# EAGLE design Combat (EAGLE 9.6.2)
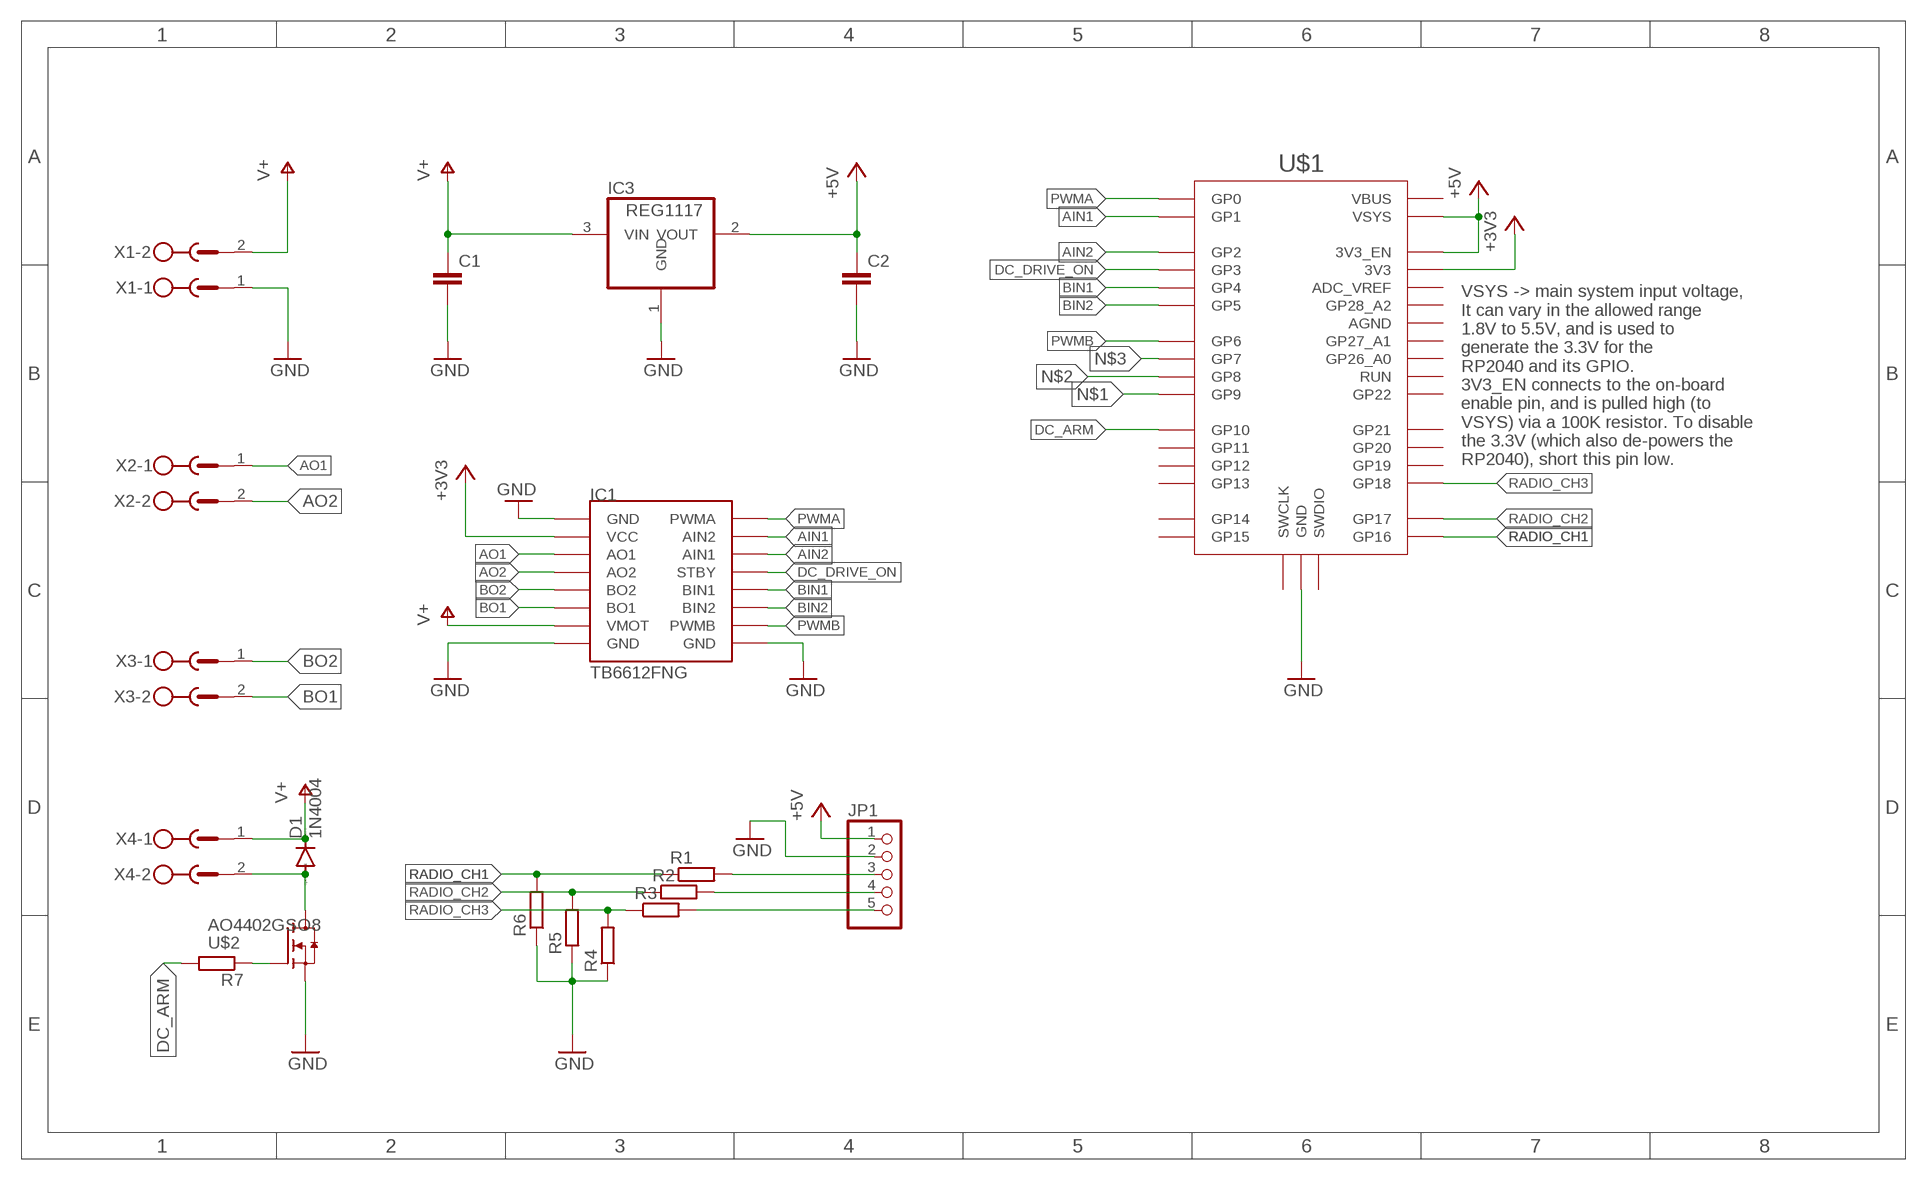
[diagram p0: schematic, sheet 1]

## Parts
C1  C-EUC1206  [C1206]
C2  C-EUC1206  [C1206]
D1  1N4004  [DO41-10]
IC1  MODUL_POLOLU  [MODUL_POLOLU]
IC3  REG1117  [SOT223]
JP1  PINHD-1X5  [1X05]
R1  R-EU_R1206  [R1206]
R2  R-EU_R1206  [R1206]
R3  R-EU_R1206  [R1206]
R4  R-EU_R1206  [R1206]
R5  R-EU_0204/7  [0204/7]
R6  R-EU_R1206  [R1206]
R7  R-EU_R1206  [R1206]
U$1  RPI_PICO-TH  [RPI_PICO_TH]
U$2  AO4402GSO8  [SO8]
X1  MSTBV2  [MSTBV2]
X2  MSTBV2  [MSTBV2]
X3  MSTBV2  [MSTBV2]
X4  MSTBV2  [MSTBV2]

## Nets
+3V3: IC1.VCC U$1.3V3
+5V: C2.1 IC3.2(VOUT) JP1.1 U$1.3V3_EN U$1.VSYS
AIN1: IC1.AIN2 U$1.GP1
AIN2: IC1.AIN1 U$1.GP2
AO1: IC1.AO1 X2.1
AO2: IC1.A02(AO2) X2.2
BIN1: IC1.BIN1 U$1.GP4
BIN2: IC1.BIN2 U$1.GP5
BO1: IC1.BO1 X3.2
BO2: IC1.BO2 X3.1
DC_ARM: R7.2 U$1.GP10
DC_DRIVE_ON: IC1.STBY U$1.GP3
GND: C1.2 C2.2 IC1.GND1(GND) IC1.GND2(GND) IC1.GND3(GND) IC3.1(GND) JP1.2 R4.1 R5.1 R6.1 U$1.GND@1(GND) U$1.GND@2(GND) U$1.GND@3(GND) U$1.GND@4(GND) U$1.GND@5(GND) U$1.GND@6(GND) U$1.GND@7(GND) U$1.GND@8(GND) U$2.1(S) U$2.2(S) U$2.3(S) X1.1
N$1: JP1.3 R1.2 U$1.GP9
N$2: JP1.4 R2.2 U$1.GP8
N$3: JP1.5 R3.2 U$1.GP7
N$4: D1.A U$2.5(D) U$2.6(D) U$2.7(D) U$2.8(D) X4.2
N$5: R7.1 U$2.4(G)
PWMA: IC1.PWMA U$1.GP0
PWMB: IC1.PWMB U$1.GP6
RADIO_CH1: R1.1 R6.2 U$1.GP16
RADIO_CH2: R2.1 R5.2 U$1.GP17
RADIO_CH3: R3.1 R4.2 U$1.GP18
V+: C1.1 D1.C IC1.VMOT IC3.3(VIN) X1.2 X4.1
Unconnected: U$1.ADC_VREF U$1.AGND U$1.GP11 U$1.GP12 U$1.GP13 U$1.GP14 U$1.GP15 U$1.GP19 U$1.GP20 U$1.GP21 U$1.GP22 U$1.GP26_A0 U$1.GP27_A1 U$1.GP28_A2 U$1.RUN U$1.SWCLK U$1.SWDIO U$1.VBUS

## Notes on the sheet
- VSYS -> main system input voltage,
  It can vary in the allowed range
  1.8V to 5.5V, and is used to
  generate the 3.3V for the
  RP2040 and its GPIO.
  3V3_EN connects to the on-board
  enable pin, and is pulled high (to
  VSYS) via a 100K resistor. To disable
  the 3.3V (which also de-powers the
  RP2040), short this pin low.

## Library data of the parts
C1 C2 = rcl:C-EU: CAPACITOR, European symbol; SPICEPREFIX: C
D1 = diode:1N4004: DIODE general purpose rectifier, 1 A
IC1 = TB6612FNG:MODUL_POLOLU
IC3 = burr-brown:REG1117: 800mA and 1A Low Dropout (LDO) Positive Regulator 1.8V, 2.5V, 2.85V, 3.3V, 5V, and Adj; MPN: REG1117; OC_FARNELL: 1097566; OC_NEWARK: 14P6981
JP1 = pinhead:PINHD-1X5: PIN HEADER
R1-R7 = rcl:R-EU_: RESISTOR, European symbol; SPICEPREFIX: R
U$1 = RaspberryPi_Pico:RPI_PICO
U$2 = AO4402G:AO4402G
X1-X4 = con-phoenix-500:MSTBV2: PHOENIX; OC_FARNELL: unknown; OC_NEWARK: unknown

## Board
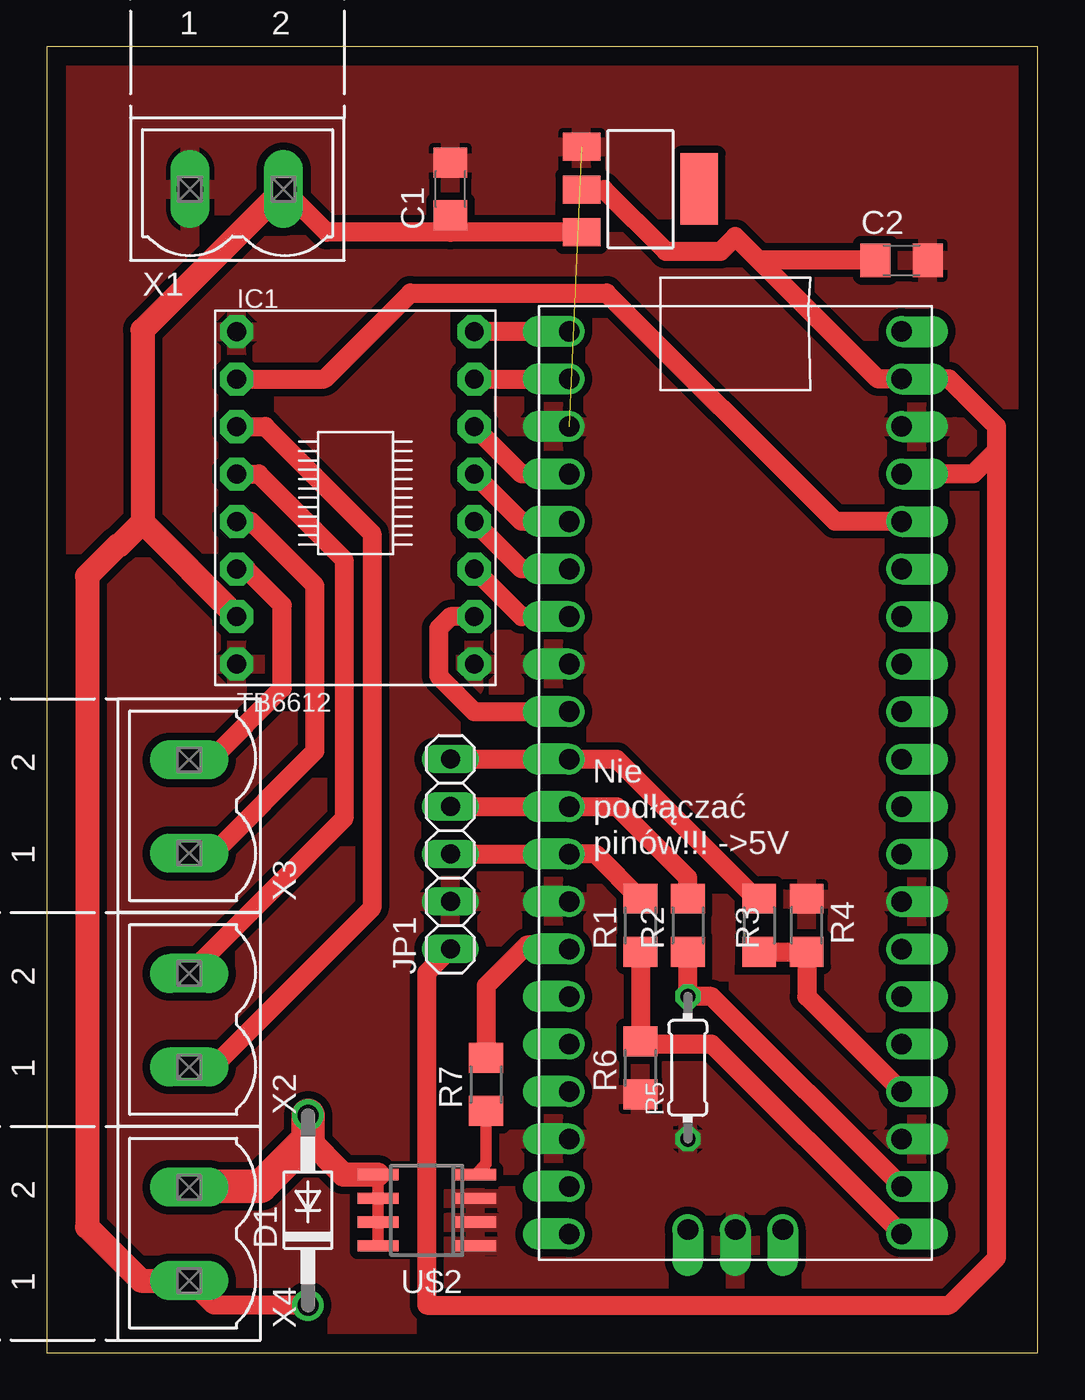
[diagram p1: board, top side]
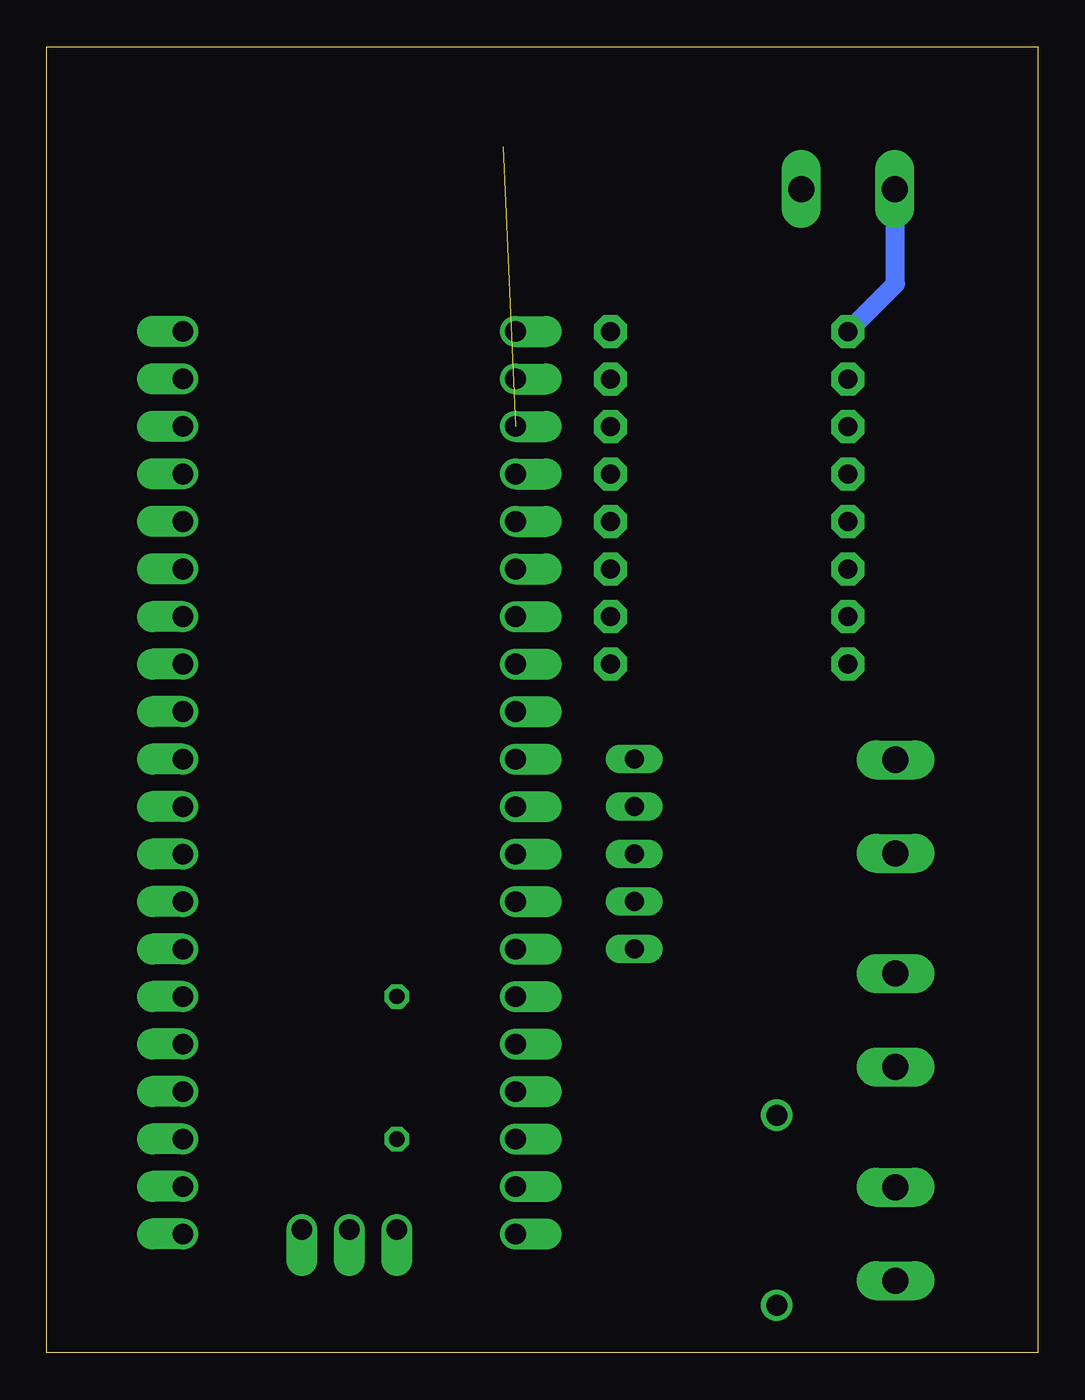
[diagram p2: board, bottom side, seen from below]

Size 53.01 x 69.84 mm. Coordinates in mm from the lower left corner, seen from the top.
Outline: 0,0 53.01,0 53.01,69.84 0,69.84 0,0
Copper layers (1*16): Top 0.035mm / dielectric 1.5mm / Bottom 0.035mm
Design rules "default *": minimum track width 6mil, minimum drill 0.35mm, track to track 10mil, track to pad 10mil, pad to pad 10mil, via to via 10mil, smd to smd 10mil, copper to edge 40mil, drill to drill 6mil, minimum pad ring 10mil, minimum via ring 8mil, stop-mask expansion 4mil, vias tented up to drill 0mil, thermal gap 10mil

### Footprints (pad centres in the part's own frame; a part is rotated, then mirrored left to right if it is on the bottom)
C1206 = smd 1.6 x 1.8: 1 -1.4,0; 2 1.4,0
DO41-10 = drill 1.118: A 5.08,0; C -5.08,0
MODUL_POLOLU = drill 1 pad 1.778 octagon: A02 -6.35,1.27; AIN1 6.35,3.81; AIN2 6.35,6.35; AO1 -6.35,3.81; BIN1 6.35,-1.27; BIN2 6.35,-3.81; BO1 -6.35,-3.81; BO2 -6.35,-1.27; GND1 -6.35,8.89; GND2 -6.35,-8.89; GND3 6.35,-8.89; PWMA 6.35,8.89; PWMB 6.35,-6.35; STBY 6.35,1.27; VCC -6.35,6.35; VMOT -6.35,-6.35
SOT223 = smd 1.499 x 2.007: 1 -2.261,-3.15; 2 0.025,-3.15; 3 2.311,-3.15 | smd 3.81 x 2.007: 4 0,3.15
1X05 = drill 1.016 long: 1 -5.08,0; 2 -2.54,0; 3 0,0; 4 2.54,0; 5 5.08,0
R1206 = smd 1.6 x 1.803: 1 -1.422,0; 2 1.422,0
0204/7 = drill 0.813 octagon: 1 -3.81,0; 2 3.81,0
RPI_PICO_TH = drill 1.1 pad 1.6 offset: 3V3 8.89,13.97; 3V3_EN 8.89,16.51; ADC_VREF 8.89,11.43; AGND 8.89,6.35; GND@1 -8.89,19.05; GND@2 -8.89,6.35; GND@3 -8.89,-6.35; GND@4 -8.89,-19.05; GND@5 0,-23.9; GND@6 8.89,-19.05; GND@7 8.89,-6.35; GND@8 8.89,19.05; GP0 -8.89,24.13; GP1 -8.89,21.59; GP2 -8.89,16.51; GP3 -8.89,13.97; GP4 -8.89,11.43; GP5 -8.89,8.89; GP6 -8.89,3.81; GP7 -8.89,1.27; GP8 -8.89,-1.27; GP9 -8.89,-3.81; GP10 -8.89,-8.89; GP11 -8.89,-11.43; GP12 -8.89,-13.97; GP13 -8.89,-16.51; GP14 -8.89,-21.59; GP15 -8.89,-24.13; GP16 8.89,-24.13; GP17 8.89,-21.59; GP18 8.89,-16.51; GP19 8.89,-13.97; GP20 8.89,-11.43; GP21 8.89,-8.89; GP22 8.89,-3.81; GP26_A0 8.89,1.27; GP27_A1 8.89,3.81; GP28_A2 8.89,8.89; RUN 8.89,-1.27; SWCLK -2.54,-23.9; SWDIO 2.54,-23.9; VBUS 8.89,24.13; VSYS 8.89,21.59
SO8 = smd 0.6 x 2.2: 1 -1.905,-2.6; 2 -0.635,-2.6; 3 0.635,-2.6; 4 1.905,-2.6; 5 1.905,2.6; 6 0.635,2.6; 7 -0.635,2.6; 8 -1.905,2.6
MSTBV2 = drill 1.397 long: 1 -2.5,0; 2 2.5,0

### Placement (x,y rotation side)
C1  21.59,62.23 90 top
C2  45.72,58.42 0 top
D1  13.97,7.62 90 top
IC1  16.51,45.72 0 top
IC3  31.75,62.23 270 top
JP1  21.59,26.67 90 top
R1  31.75,22.86 90 top
R2  34.29,22.86 90 top
R3  38.1,22.86 90 top
R4  40.64,22.86 270 top
R5  34.29,15.24 90 top
R6  31.75,15.24 90 top
R7  23.5,14.35 90 top
U$1  36.83,30.48 0 top
U$2  20.32,7.62 90 top
X1  10.16,62.23 0 top
X2  7.62,17.78 90 top
X3  7.62,29.21 90 top
X4  7.62,6.35 90 top

### Tracks (layer width: path | path; a pad name or v marks a point on that pad's centre or on a via)
+3V3
  Top 1.016: U$1.3V3 42.16,44.45 29.95,56.67 19.45,56.67 14.86,52.07 IC1.VCC
+5V
  Top 1.016: 50.8,48.26 50.8,5.08 48.26,2.54 20.32,2.54 20.32,20.32 JP1.1 | 50.8,48.26 50.8,49.53 48.26,52.07 U$1.VSYS 44.45,52.07 38.1,58.42 | 50.8,48.26 49.53,46.99 U$1.3V3_EN | 38.1,58.42 36.83,59.69 36.04,58.9 33.12,58.9 29.81,62.2 IC3.2 | C2.1 38.1,58.42
AIN1
  Top 1.016: IC1.AIN2 U$1.GP1
AIN2
  Top 1.016: U$1.GP2 25.4,46.99 IC1.AIN1
AO1
  Top 1.016: IC1.AO1 11.68,49.53 17.4,43.81 17.4,23.79 8.89,15.28 X2.1
AO2
  Top 1.016: IC1.A02 11.34,46.99 15.9,42.42 15.9,28.56 X2.2
BIN1
  Top 1.016: U$1.GP4 25.4,41.91 IC1.BIN1
BIN2
  Top 1.016: U$1.GP5 25.4,39.37 IC1.BIN2
BO1
  Top 1.016: X3.2 8.76,31.71 12.6,35.55 12.6,39.98 10.67,41.91 IC1.BO1
BO2
  Top 1.016: X3.1 8.89,26.71 14.35,32.17 14.35,41.02 10.92,44.45 IC1.BO2
DC_ARM
  Top 1.016: U$1.GP10 27.73,21.8 25.68,21.8 23.5,19.63 R7.2
DC_DRIVE_ON
  Top 1.016: U$1.GP3 25.4,44.45 IC1.STBY
GND  (1 unrouted)
  Bottom 1.016: X1.1 7.66,57.19 7.62,57.15 IC1.GND1
  pour Top (isolate 0.406): 0,-1.27 0,69.85 53.34,69.85 53.34,-1.27
N$1
  Top 1.016: JP1.3 U$1.GP9 29.36,26.67 R1.2
N$2
  Top 1.016: JP1.4 U$1.GP8 30.48,29.21 34.29,25.4 R2.2
N$3
  Top 1.016: JP1.5 U$1.GP7 30.48,31.75 37.95,24.28 R3.2
N$4
  Top 0.61: U$2.5 U$2.6 U$2.7 U$2.8
  Top 1.27: U$2.5 15.88,9.53 13.97,11.43
  Top 1.778: X4.2 7.66,8.89 11.43,8.89 13.97,11.43 D1.A
N$5
  Top 0.61: R7.1 23.5,10.1 U$2.4
PWMA
  Top 1.016: U$1.GP0 IC1.PWMA
PWMB
  Top 1.016: 26.73,34.29 U$1.GP6 22.86,34.29 20.95,36.2 20.95,38.73 21.59,39.37 IC1.PWMB
RADIO_CH1
  Top 1.016: R1.1 R6.2 31.9,16.51 35.56,16.51 U$1.GP16
RADIO_CH2
  Top 1.016: U$1.GP17 35.56,19.05 R5.2 R2.1
RADIO_CH3
  Top 1.016: R3.1 R4.2 40.64,19.05 U$1.GP18
V+
  Top 1.016: D1.C 8.93,2.54 X4.1 | IC3.3 21.59,59.92 | 21.59,59.92 14.97,59.92 X1.2 | C1.1 21.59,59.92
  Top 1.27: 5.12,44.41 IC1.VMOT | 5.12,44.41 5.12,54.69 X1.2 | X4.1 5.04,3.85 2.16,6.73 2.16,41.53 3.81,43.18 3.89,43.18 5.12,44.41

### Text on the board
tNames: Nie / podłączać / pinów!!! ->5V